# Altium schematic sheet DIP Switch.SchDoc
size Letter
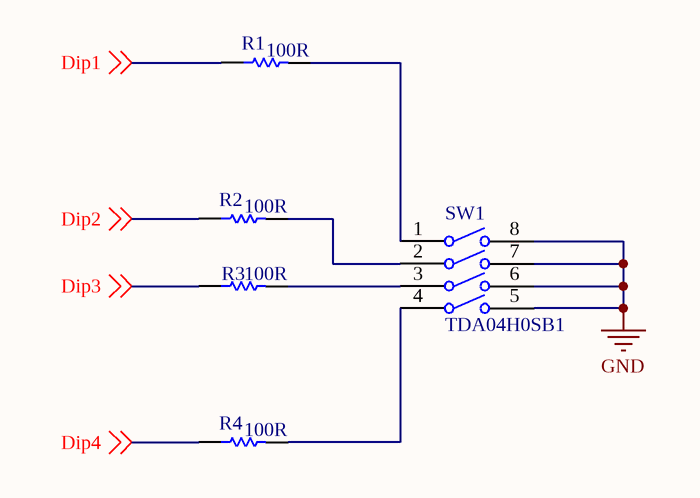
[diagram p0: DIP Switch.SchDoc]

## Parts
R1  100R  [RESC0805(2012)_N]
R2  100R  [RESC0805(2012)_N]
R3  100R  [RESC0805(2012)_N]
R4  100R  [RESC0805(2012)_N]
SW1  TDA04H0SB1  [CKCP-TDA04H0SB1R_V]

## Nets
GND: SW1.5 SW1.6 SW1.7 SW1.8
Dip1: R1.1 ; off-sheet Dip1
Dip2: R2.1 ; off-sheet Dip2
Dip3: R3.1 ; off-sheet Dip3
Dip4: R4.1 ; off-sheet Dip4
NetR1_2: R1.2 SW1.1
NetR2_2: R2.2 SW1.2
NetR3_2: R3.2 SW1.3
NetR4_2: R4.2 SW1.4

## Notes on the sheet
- Title
- Size:
- Date:
- Letter
- Number:
- Time:
- Revision:
- Sheet
- of
- File:

## Library data of the parts
R1-R4 = 120R 5% 0805: 120R 0.125W 5% 0805 (2012 Metric)  SMD; Case-Metric: 2012; Value: 120.00 Ohm; Case-EIA: 0805; Tolerance: 5 %; Technology: SMT; Power: 0.125 W
SW1 = SMD Half-Pitch Dip Switch Array: Ultra-Miniature Surface Mount Half-Pitch DIP Switch, 25 mA, 24 V, -40 to 85 degC, 8-Pin SMD, RoHS, Tube; Contact Current Rating: 100 mA; Throw Configuration: SPST; Voltage Rating (DC): 24 V; Max Contact Resistance: 100 mohm; Max Current Rating: 25 mA; REACH SVHC: No SVHC; DatasheetVersion: 02/2016; Case\Package: DIP; Package Quantity: 70; Lead Pitch: 1.27 mm; Contact Plating: Gold; Packaging: Rail/Tube; Contact Finish: Gold; Mount: Surface Mount; Height: 2.3 mm; Contact Material: Copper; Max Operating Temperature: 85 degC; Max Voltage Rating (DC): 24 V; ComponentLink1URL: http://www.ck-components.com/media/1328/tda.pdf; PackageDescription: 8-Pin Surface Mount Device, Body 6.21 x 6.2 mm, Pitch 1.27 mm; Radiation Hardening: No; ComponentLink1Description: Datasheet; Current Rating: 100 mA; RoHSCompliant: true; PackageReference: TDA04H0SB1R; Min Operating Temperature: -40 degC; Pins: 4; Mounting Technology: Surface Mount; Length: 6.21 mm